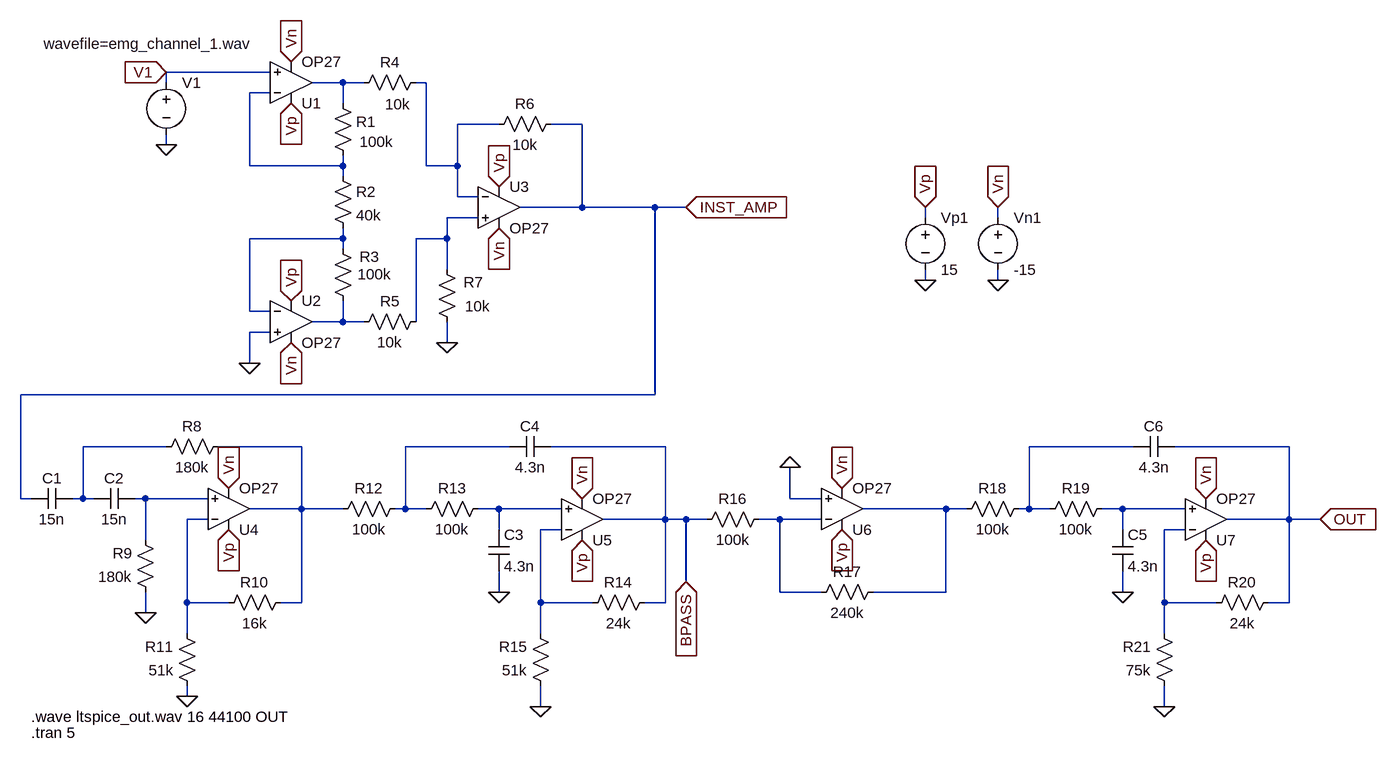
[diagram p0: schematic circuit.asc]
circuit.asc, the LTspice schematic file:
Version 4
SHEET 1 2924 996
WIRE 320 -64 160 -64
WIRE 160 -48 160 -64
WIRE 432 -48 384 -48
WIRE 464 -48 432 -48
WIRE 560 -48 544 -48
WIRE 320 -32 288 -32
WIRE 432 -16 432 -48
WIRE 672 16 608 16
WIRE 800 16 752 16
WIRE 160 48 160 32
WIRE 288 80 288 -32
WIRE 432 80 432 64
WIRE 432 80 288 80
WIRE 560 80 560 -48
WIRE 608 80 608 16
WIRE 608 80 560 80
WIRE 432 96 432 80
WIRE 608 128 608 80
WIRE 640 128 608 128
WIRE 800 144 800 16
WIRE 800 144 704 144
WIRE 912 144 800 144
WIRE 960 144 912 144
WIRE 640 160 592 160
WIRE 1328 160 1328 144
WIRE 1440 160 1440 144
WIRE 432 192 432 176
WIRE 432 192 288 192
WIRE 592 192 592 160
WIRE 592 192 544 192
WIRE 432 208 432 192
WIRE 592 240 592 192
WIRE 1328 256 1328 240
WIRE 1440 256 1440 240
WIRE 288 304 288 192
WIRE 320 304 288 304
WIRE 432 320 432 288
WIRE 432 320 384 320
WIRE 464 320 432 320
WIRE 544 320 544 192
WIRE 320 336 288 336
WIRE 592 352 592 320
WIRE 288 384 288 336
WIRE 912 432 912 144
WIRE 912 432 -64 432
WIRE 160 512 32 512
WIRE 368 512 240 512
WIRE 688 512 528 512
WIRE 928 512 752 512
WIRE 1648 512 1488 512
WIRE 1888 512 1712 512
WIRE -64 592 -64 432
WIRE -48 592 -64 592
WIRE 32 592 32 512
WIRE 32 592 16 592
WIRE 48 592 32 592
WIRE 128 592 112 592
WIRE 224 592 128 592
WIRE 1120 592 1120 544
WIRE 1168 592 1120 592
WIRE 368 608 368 512
WIRE 368 608 288 608
WIRE 432 608 368 608
WIRE 528 608 528 512
WIRE 528 608 512 608
WIRE 560 608 528 608
WIRE 672 608 640 608
WIRE 768 608 672 608
WIRE 1360 608 1232 608
WIRE 1392 608 1360 608
WIRE 1488 608 1488 512
WIRE 1488 608 1472 608
WIRE 1520 608 1488 608
WIRE 1632 608 1600 608
WIRE 1728 608 1632 608
WIRE 224 624 192 624
WIRE 928 624 928 512
WIRE 928 624 832 624
WIRE 960 624 928 624
WIRE 992 624 960 624
WIRE 1104 624 1072 624
WIRE 1168 624 1104 624
WIRE 1888 624 1888 512
WIRE 1888 624 1792 624
WIRE 1936 624 1888 624
WIRE 672 640 672 608
WIRE 768 640 736 640
WIRE 1632 640 1632 608
WIRE 1728 640 1696 640
WIRE 128 656 128 592
WIRE 960 720 960 624
WIRE 672 736 672 704
WIRE 1104 736 1104 624
WIRE 1168 736 1104 736
WIRE 1360 736 1360 608
WIRE 1360 736 1248 736
WIRE 1632 736 1632 704
WIRE 192 752 192 624
WIRE 256 752 192 752
WIRE 368 752 368 608
WIRE 368 752 336 752
WIRE 736 752 736 640
WIRE 816 752 736 752
WIRE 928 752 928 624
WIRE 928 752 896 752
WIRE 1696 752 1696 640
WIRE 1776 752 1696 752
WIRE 1888 752 1888 624
WIRE 1888 752 1856 752
WIRE 128 768 128 736
WIRE 192 800 192 752
WIRE 736 800 736 752
WIRE 1696 800 1696 752
WIRE 192 896 192 880
WIRE 736 912 736 880
WIRE 1696 912 1696 880
FLAG 592 352 0
FLAG 160 -64 V1
IOPIN 160 -64 In
FLAG 352 288 Vp
IOPIN 352 288 In
FLAG 352 -16 Vp
IOPIN 352 -16 In
FLAG 672 112 Vp
IOPIN 672 112 In
FLAG 352 -80 Vn
IOPIN 352 -80 In
FLAG 352 352 Vn
IOPIN 352 352 In
FLAG 672 176 Vn
IOPIN 672 176 In
FLAG 128 768 0
FLAG 192 896 0
FLAG 256 576 Vn
IOPIN 256 576 In
FLAG 256 640 Vp
IOPIN 256 640 In
FLAG 672 736 0
FLAG 736 912 0
FLAG 800 592 Vn
IOPIN 800 592 In
FLAG 800 656 Vp
IOPIN 800 656 In
FLAG 1120 544 0
FLAG 1200 576 Vn
IOPIN 1200 576 In
FLAG 1200 640 Vp
IOPIN 1200 640 In
FLAG 1632 736 0
FLAG 1696 912 0
FLAG 1760 592 Vn
IOPIN 1760 592 In
FLAG 1760 656 Vp
IOPIN 1760 656 In
FLAG 1936 624 OUT
IOPIN 1936 624 In
FLAG 1328 256 0
FLAG 1440 256 0
FLAG 1328 144 Vp
IOPIN 1328 144 In
FLAG 1440 144 Vn
IOPIN 1440 144 In
FLAG 960 720 BPASS
IOPIN 960 720 In
FLAG 960 144 INST_AMP
IOPIN 960 144 In
FLAG 288 384 0
FLAG 160 48 0
SYMBOL Opamps\\OP27 352 16 M180
SYMATTR InstName U1
SYMBOL Opamps\\OP27 352 256 R0
SYMATTR InstName U2
SYMBOL Opamps\\OP27 672 80 R0
SYMATTR InstName U3
SYMBOL res 448 80 R180
WINDOW 0 -35 68 Left 2
WINDOW 3 -62 37 Left 2
SYMATTR InstName R1
SYMATTR Value 100k
SYMBOL res 416 80 R0
SYMATTR InstName R2
SYMATTR Value 40k
SYMBOL res 448 304 R180
WINDOW 0 -40 84 Left 2
WINDOW 3 -59 57 Left 2
SYMATTR InstName R3
SYMATTR Value 100k
SYMBOL res 560 -64 R90
WINDOW 0 0 56 VBottom 2
WINDOW 3 34 44 VTop 2
SYMATTR InstName R4
SYMATTR Value 10k
SYMBOL res 560 304 R90
WINDOW 0 0 56 VBottom 2
WINDOW 3 32 56 VTop 2
SYMATTR InstName R5
SYMATTR Value 10k
SYMBOL res 768 0 R90
WINDOW 0 0 56 VBottom 2
WINDOW 3 32 56 VTop 2
SYMATTR InstName R6
SYMATTR Value 10k
SYMBOL res 608 336 R180
WINDOW 0 -40 77 Left 2
WINDOW 3 -51 40 Left 2
SYMATTR InstName R7
SYMATTR Value 10k
SYMBOL Opamps\\OP27 256 672 M180
SYMATTR InstName U4
SYMBOL Opamps\\OP27 800 688 M180
SYMATTR InstName U5
SYMBOL Opamps\\OP27 1200 672 M180
SYMATTR InstName U6
SYMBOL cap 16 576 R90
WINDOW 0 0 32 VBottom 2
WINDOW 3 32 32 VTop 2
SYMATTR InstName C1
SYMATTR Value 15n
SYMBOL cap 48 608 R270
WINDOW 0 32 32 VTop 2
WINDOW 3 0 32 VBottom 2
SYMATTR InstName C2
SYMATTR Value 15n
SYMBOL res 256 496 R90
WINDOW 0 0 56 VBottom 2
WINDOW 3 32 56 VTop 2
SYMATTR InstName R8
SYMATTR Value 180k
SYMBOL res 144 752 R180
WINDOW 0 36 76 Left 2
WINDOW 3 36 40 Left 2
SYMATTR InstName R9
SYMATTR Value 180k
SYMBOL res 352 736 R90
WINDOW 0 0 56 VBottom 2
WINDOW 3 32 56 VTop 2
SYMATTR InstName R10
SYMATTR Value 16k
SYMBOL res 208 896 R180
WINDOW 0 36 76 Left 2
WINDOW 3 36 40 Left 2
SYMATTR InstName R11
SYMATTR Value 51k
SYMBOL res 528 592 R90
WINDOW 0 0 56 VBottom 2
WINDOW 3 32 56 VTop 2
SYMATTR InstName R12
SYMATTR Value 100k
SYMBOL res 656 592 R90
WINDOW 0 0 56 VBottom 2
WINDOW 3 32 56 VTop 2
SYMATTR InstName R13
SYMATTR Value 100k
SYMBOL cap 656 640 R0
SYMATTR InstName C3
SYMATTR Value 4.3n
SYMBOL cap 688 528 R270
WINDOW 0 32 32 VTop 2
WINDOW 3 0 32 VBottom 2
SYMATTR InstName C4
SYMATTR Value 4.3n
SYMBOL res 800 768 R270
WINDOW 0 32 56 VTop 2
WINDOW 3 0 56 VBottom 2
SYMATTR InstName R14
SYMATTR Value 24k
SYMBOL res 752 896 R180
WINDOW 0 36 76 Left 2
WINDOW 3 36 40 Left 2
SYMATTR InstName R15
SYMATTR Value 51k
SYMBOL res 976 640 R270
WINDOW 0 32 56 VTop 2
WINDOW 3 0 56 VBottom 2
SYMATTR InstName R16
SYMATTR Value 100k
SYMBOL res 1152 752 R270
WINDOW 0 32 56 VTop 2
WINDOW 3 0 56 VBottom 2
SYMATTR InstName R17
SYMATTR Value 240k
SYMBOL Opamps\\OP27 1760 688 M180
SYMATTR InstName U7
SYMBOL res 1488 592 R90
WINDOW 0 0 56 VBottom 2
WINDOW 3 32 56 VTop 2
SYMATTR InstName R18
SYMATTR Value 100k
SYMBOL res 1616 592 R90
WINDOW 0 0 56 VBottom 2
WINDOW 3 32 56 VTop 2
SYMATTR InstName R19
SYMATTR Value 100k
SYMBOL cap 1616 640 R0
SYMATTR InstName C5
SYMATTR Value 4.3n
SYMBOL cap 1648 528 R270
WINDOW 0 32 32 VTop 2
WINDOW 3 0 32 VBottom 2
SYMATTR InstName C6
SYMATTR Value 4.3n
SYMBOL res 1760 768 R270
WINDOW 0 32 56 VTop 2
WINDOW 3 0 56 VBottom 2
SYMATTR InstName R20
SYMATTR Value 24k
SYMBOL res 1712 896 R180
WINDOW 0 36 76 Left 2
WINDOW 3 36 40 Left 2
SYMATTR InstName R21
SYMATTR Value 75k
SYMBOL voltage 1440 144 R0
WINDOW 123 0 0 Left 0
WINDOW 39 0 0 Left 0
SYMATTR InstName Vn1
SYMATTR Value -15
SYMBOL voltage 1328 144 R0
WINDOW 123 0 0 Left 0
WINDOW 39 0 0 Left 0
SYMATTR InstName Vp1
SYMATTR Value 15
SYMBOL voltage 160 -64 R0
WINDOW 3 -189 -44 Left 2
WINDOW 123 0 0 Left 0
WINDOW 39 0 0 Left 0
SYMATTR Value wavefile=emg_channel_1.wav
SYMATTR InstName V1
TEXT -48 952 Left 2 !.tran 5
TEXT -48 928 Left 2 !.wave ltspice_out.wav 16 44100 OUT

The netlist it stands for:
* circuit.asc
XU1 V1 N003 Vp Vn N001 OP27  ; pins In+ In- V+ V- OUT
XU2 0 N005 Vp Vn N006 OP27  ; pins In+ In- V+ V- OUT
XU3 N004 N002 Vp Vn INST_AMP OP27  ; pins In+ In- V+ V- OUT
R1 N003 N001 100k
R2 N003 N005 40k
R3 N006 N005 100k
R4 N002 N001 10k
R5 N004 N006 10k
R6 INST_AMP N002 10k
R7 0 N004 10k
XU4 N011 N015 Vp Vn N008 OP27  ; pins In+ In- V+ V- OUT
XU5 N012 N017 Vp Vn BPASS OP27  ; pins In+ In- V+ V- OUT
XU6 0 N016 Vp Vn N013 OP27  ; pins In+ In- V+ V- OUT
C1 N007 INST_AMP 15n
C2 N007 N011 15n
R8 N008 N007 180k
R9 0 N011 180k
R10 N008 N015 16k
R11 0 N015 51k
R12 N009 N008 100k
R13 N012 N009 100k
C3 N012 0 4.3n
C4 N009 BPASS 4.3n
R14 N017 BPASS 24k
R15 0 N017 51k
R16 BPASS N016 100k
R17 N016 N013 240k
XU7 N014 N018 Vp Vn OUT OP27  ; pins In+ In- V+ V- OUT
R18 N010 N013 100k
R19 N014 N010 100k
C5 N014 0 4.3n
C6 N010 OUT 4.3n
R20 N018 OUT 24k
R21 0 N018 75k
Vn1 Vn 0 -15
Vp1 Vp 0 15
V1 V1 0 wavefile=emg_channel_1.wav
.tran 5
.wave ltspice_out.wav 16 44100 OUT
.lib ADI.lib
.backanno
.end